# EAGLE design 4ch_v3 (EAGLE 5.11)
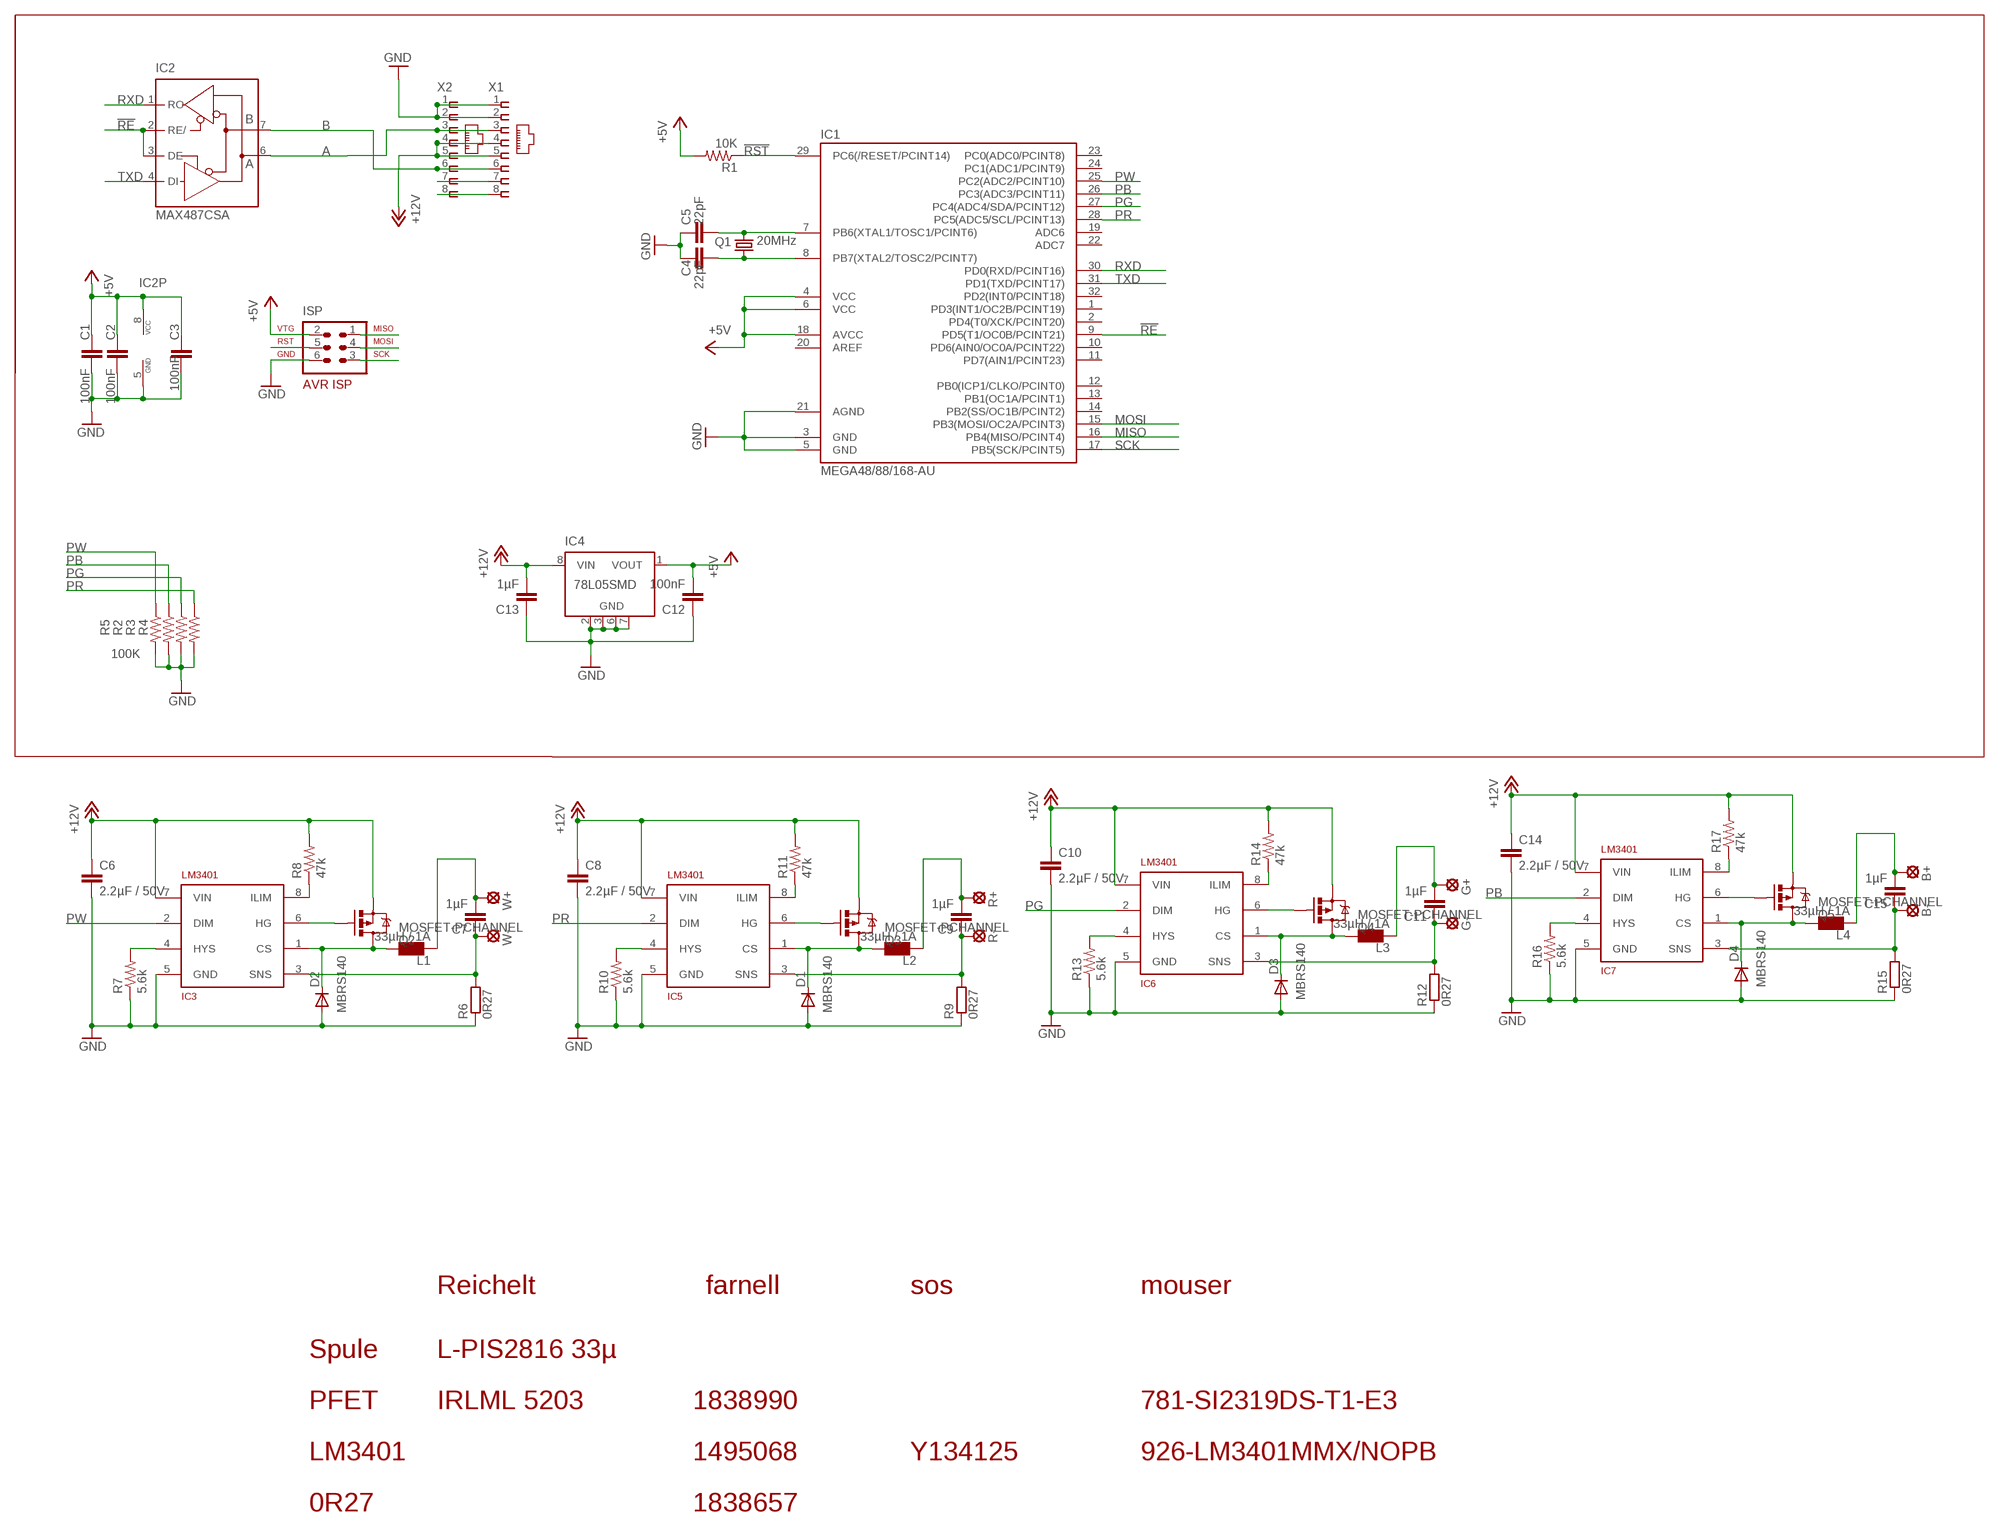
[diagram p0: schematic, sheet 1]

## Parts
B+  SE14  [SE14]
B-  SE14  [SE14]
C1  100nF  CAP0402-CAP  [0402-CAP]
C2  100nF  CAP0402-CAP  [0402-CAP]
C3  100nF  CAP0402-CAP  [0402-CAP]
C4  22pF  CAP0402-CAP  [0402-CAP]
C5  22pF  CAP0402-CAP  [0402-CAP]
C6  2.2µF / 50V  C-EUC1210  [C1210]
C7  1µF  CAP0805  [0805]
C8  2.2µF / 50V  C-EUC1210  [C1210]
C9  1µF  CAP0805  [0805]
C10  2.2µF / 50V  C-EUC1210  [C1210]
C11  1µF  CAP0805  [0805]
C12  100nF  CAP0402-CAP  [0402-CAP]
C13  1µF  CAP0805  [0805]
C14  2.2µF / 50V  C-EUC1210  [C1210]
C15  1µF  CAP0805  [0805]
D1  MBRS140  DIODE-SMB  [SMB]
D2  MBRS140  DIODE-SMB  [SMB]
D3  MBRS140  DIODE-SMB  [SMB]
D4  MBRS140  DIODE-SMB  [SMB]
G+  SE14  [SE14]
G-  SE14  [SE14]
IC1  MEGA48/88/168-AU  [TQFP32-08]
IC2  MAX487CSA  MAX481CSA  [SO08]
IC3  LM3401  [MSOP8]
IC4  78L05SMD  [SO08]
IC5  LM3401  [MSOP8]
IC6  LM3401  [MSOP8]
IC7  LM3401  [MSOP8]
ISP  AVR-ISP-6  [AVR-ISP-6]
L1  33µH / 1A  L_PIS2816  [PIS2816]
L2  33µH / 1A  L_PIS2816  [PIS2816]
L3  33µH / 1A  L_PIS2816  [PIS2816]
L4  33µH / 1A  L_PIS2816  [PIS2816]
Q1  20MHz  X22-OSCILLATOR  [X22]
Q2  MOSFET-PCHANNEL  [SOT23]
Q3  MOSFET-PCHANNEL  [SOT23]
Q4  MOSFET-PCHANNEL  [SOT23]
Q5  MOSFET-PCHANNEL  [SOT23]
R1  10K  RESISTOR0402-RES  [0402-RES]
R2  100K  RESISTOR0402-RES  [0402-RES]
R3  100K  RESISTOR0402-RES  [0402-RES]
R4  100K  RESISTOR0402-RES  [0402-RES]
R5  100K  RESISTOR0402-RES  [0402-RES]
R6  0R27  R-EU_R1206  [R1206]
R7  5.6k  RESISTOR0805-RES  [0805]
R8  47k  RESISTOR0805-RES  [0805]
R9  0R27  R-EU_R1206  [R1206]
R10  5.6k  RESISTOR0805-RES  [0805]
R11  47k  RESISTOR0805-RES  [0805]
R12  0R27  R-EU_R1206  [R1206]
R13  5.6k  RESISTOR0805-RES  [0805]
R14  47k  RESISTOR0805-RES  [0805]
R15  0R27  R-EU_R1206  [R1206]
R16  5.6k  RESISTOR0805-RES  [0805]
R17  47k  RESISTOR0805-RES  [0805]
R+  SE14  [SE14]
R-  SE14  [SE14]
W+  SE14  [SE14]
W-  SE14  [SE14]
X1  RJ45-8L-B  [RJ45-NO-SHIELD]
X2  RJ45-8L-B  [RJ45-NO-SHIELD]

## Nets
!RE: IC1.9(PD5(T1/OC0B/PCINT21)) IC2.2(RE/) IC2.3(DE)
!RST: IC1.29(PC6(/RESET/PCINT14)) ISP.5 R1.1
+5V: C1.1 C2.1 C3.1 C12.2 IC1.4(VCC) IC1.6(VCC) IC1.18(AVCC) IC2.8(VCC) IC4.1(VOUT) ISP.2 R1.2
+12V: C6.1 C8.1 C10.1 C13.2 C14.1 IC3.7(VIN) IC4.8(VIN) IC5.7(VIN) IC6.7(VIN) IC7.7(VIN) Q2.2(S) Q3.2(S) Q4.2(S) Q5.2(S) R8.2 R11.2 R14.2 R17.2 X1.4 X1.5 X2.4 X2.5
A: IC2.6(A) X1.3 X2.3
B: IC2.7(B) X1.6 X2.6
GND: C1.2 C2.2 C3.2 C4.1 C5.1 C6.2 C8.2 C10.2 C12.1 C13.1 C14.2 D1.A D2.A D3.A D4.A IC1.3(GND) IC1.5(GND) IC1.21(AGND) IC2.5(GND) IC3.5(GND) IC4.2(GND) IC4.3(GND) IC4.6(GND) IC4.7(GND) IC5.5(GND) IC6.5(GND) IC7.5(GND) ISP.6 R2.2 R3.2 R4.2 R5.2 R6.1 R7.1 R9.1 R10.1 R12.1 R13.1 R15.1 R16.1 X1.1 X1.2 X2.1 X2.2
MISO: IC1.16(PB4(MISO/PCINT4)) ISP.1
MOSI: IC1.15(PB3(MOSI/OC2A/PCINT3)) ISP.4
N$1: C7.1 IC3.3(SNS) R6.2 W-.MP
N$2: C7.2 L1.P$2 W+.MP
N$3: D2.C IC3.1(CS) L1.P$1 Q2.3(D)
N$4: C9.1 IC5.3(SNS) R9.2 R-.MP
N$5: IC3.4(HYS) R7.2
N$6: C9.2 L2.P$2 R+.MP
N$7: IC3.8(ILIM) R8.1
N$8: D1.C IC5.1(CS) L2.P$1 Q3.3(D)
N$9: IC5.4(HYS) R10.2
N$10: IC3.6(HG) Q2.1(G)
N$11: IC5.8(ILIM) R11.1
N$12: IC5.6(HG) Q3.1(G)
N$13: C11.1 G-.MP IC6.3(SNS) R12.2
N$14: C11.2 G+.MP L3.P$2
N$15: D3.C IC6.1(CS) L3.P$1 Q4.3(D)
N$16: IC6.4(HYS) R13.2
N$17: IC6.8(ILIM) R14.1
N$18: X1.7 X2.7
N$19: X1.8 X2.8
N$20: IC6.6(HG) Q4.1(G)
N$21: B-.MP C15.1 IC7.3(SNS) R15.2
N$22: B+.MP C15.2 L4.P$2
N$23: D4.C IC7.1(CS) L4.P$1 Q5.3(D)
N$24: IC7.4(HYS) R16.2
N$25: IC7.8(ILIM) R17.1
N$26: IC7.6(HG) Q5.1(G)
PB: IC1.26(PC3(ADC3/PCINT11)) IC7.2(DIM) R2.1
PG: IC1.27(PC4(ADC4/SDA/PCINT12)) IC6.2(DIM) R3.1
PR: IC1.28(PC5(ADC5/SCL/PCINT13)) IC5.2(DIM) R4.1
PW: IC1.25(PC2(ADC2/PCINT10)) IC3.2(DIM) R5.1
RXD: IC1.30(PD0(RXD/PCINT16)) IC2.1(RO)
SCK: IC1.17(PB5(SCK/PCINT5)) ISP.3
TXD: IC1.31(PD1(TXD/PCINT17)) IC2.4(DI)
XTAL1: C5.2 IC1.7(PB6(XTAL1/TOSC1/PCINT6)) Q1.3
XTAL2: C4.2 IC1.8(PB7(XTAL2/TOSC2/PCINT7)) Q1.1
Unconnected: IC1.1(PD3(INT1/OC2B/PCINT19)) IC1.2(PD4(T0/XCK/PCINT20)) IC1.10(PD6(AIN0/OC0A/PCINT22)) IC1.11(PD7(AIN1/PCINT23)) IC1.12(PB0(ICP1/CLKO/PCINT0)) IC1.13(PB1(OC1A/PCINT1)) IC1.14(PB2(SS/OC1B/PCINT2)) IC1.19(ADC6) IC1.20(AREF) IC1.22(ADC7) IC1.23(PC0(ADC0/PCINT8)) IC1.24(PC1(ADC1/PCINT9)) IC1.32(PD2(INT0/PCINT18)) IC4.4(NC) IC4.5(NC)

## Notes on the sheet
- Reichelt | farnell | sos | mouser
- Spule | L-PIS2816 33µ
- PFET | IRLML 5203 | 1838990 | 781-SI2319DS-T1-E3
- LM3401 | 1495068 | Y134125 | 926-LM3401MMX/NOPB
- 0R27 | 1838657

## Library data of the parts
B+ B- G+ G- R+ R- W+ W- = solpad:SE14: SOLDER PAD E1553, drill 1,4mm, distributor Buerklin, 07F820
C1-C5 C7 C9 C11-C13 C15 = SparkFun:CAP: Capacitor Standard 0603 ceramic capacitor, and 0.1" leaded capacitor.
C6 C8 C10 C14 = rcl:C-EU: CAPACITOR, European symbol
D1-D4 = diode:DIODE-: DIODE
IC1 = avr-7:MEGA48/88/168
IC2 = maxim:MAX481CSA: RS485 TRANSEIVER; MF: MAXIM; MPN: MAX481CSA; OC_FARNELL: unknown; OC_NEWARK: 90C3817
IC3 IC5-IC7 = seb:LM3401
IC4 = linear:78L*SMD: Positive VOLTAGE REGULATOR
ISP = atmel:AVR-ISP-6: AVR ISP-6 Serial Programming Header
L1-L4 = seb:L_PIS2816
Q1 = seb:X22-OSCILLATOR
Q2-Q5 = SparkFun:MOSFET-PCHANNEL
R1-R5 R7 R8 R10 R11 R13 R14 R16 R17 = SparkFun:RESISTOR: Resistor Basic schematic elements and footprints for 0603, 1206, and PTH resistors.
R6 R9 R12 R15 = rcl:R-EU_: RESISTOR, European symbol
X1 X2 = con-tycoelectronics:RJ45: CORCOM Modular RJ Jacks No Shield Source: www.tycoelectronics.com .. ENG_DS_1654001_1099_RJ_L_0507.pdf; MF: TYCO ELECTRONICS; MPN: RJ45-8L-B; OC_FARNELL: 1279843; OC_NEWARK: 52K4445

## Board
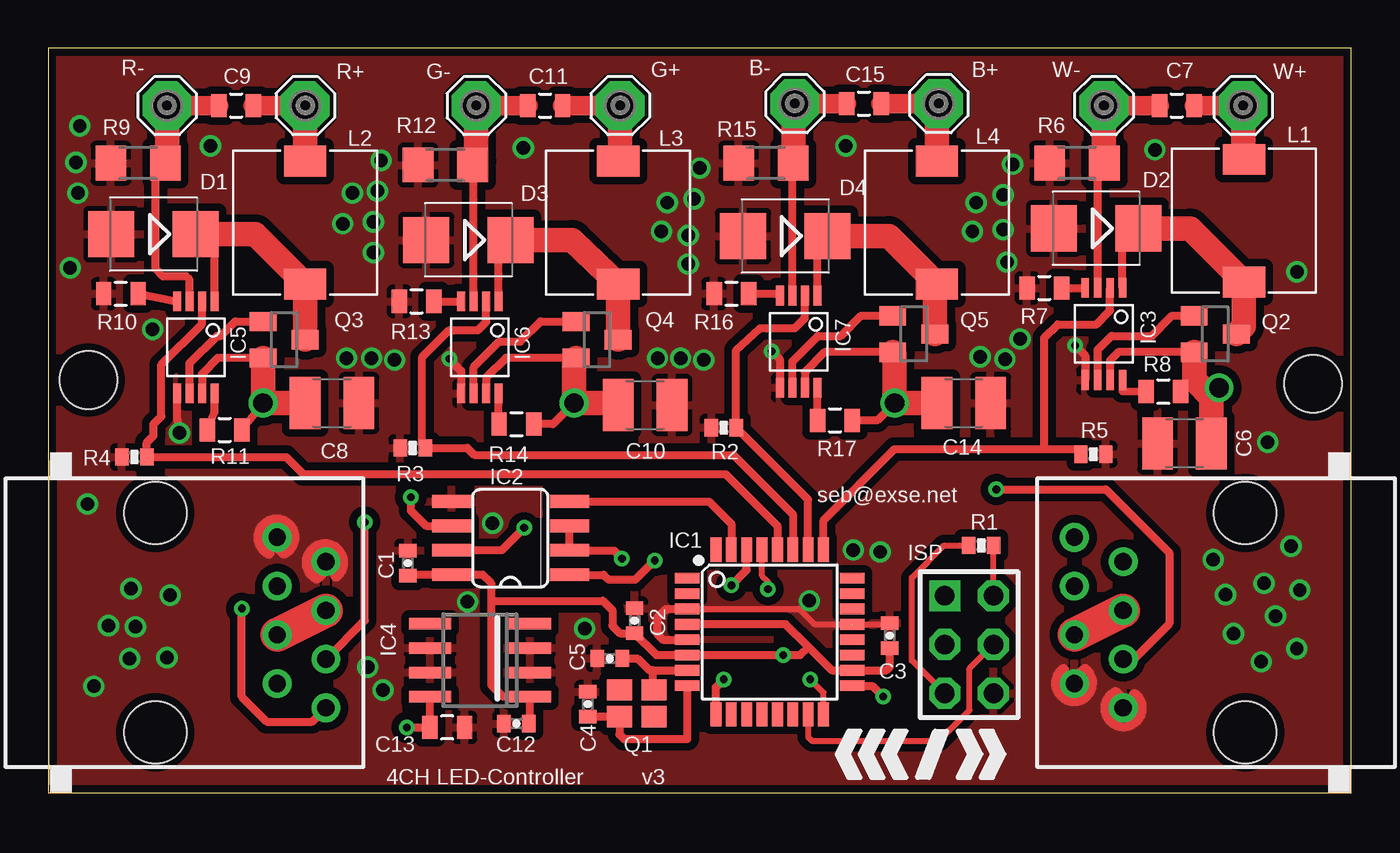
[diagram p1: board, top side]
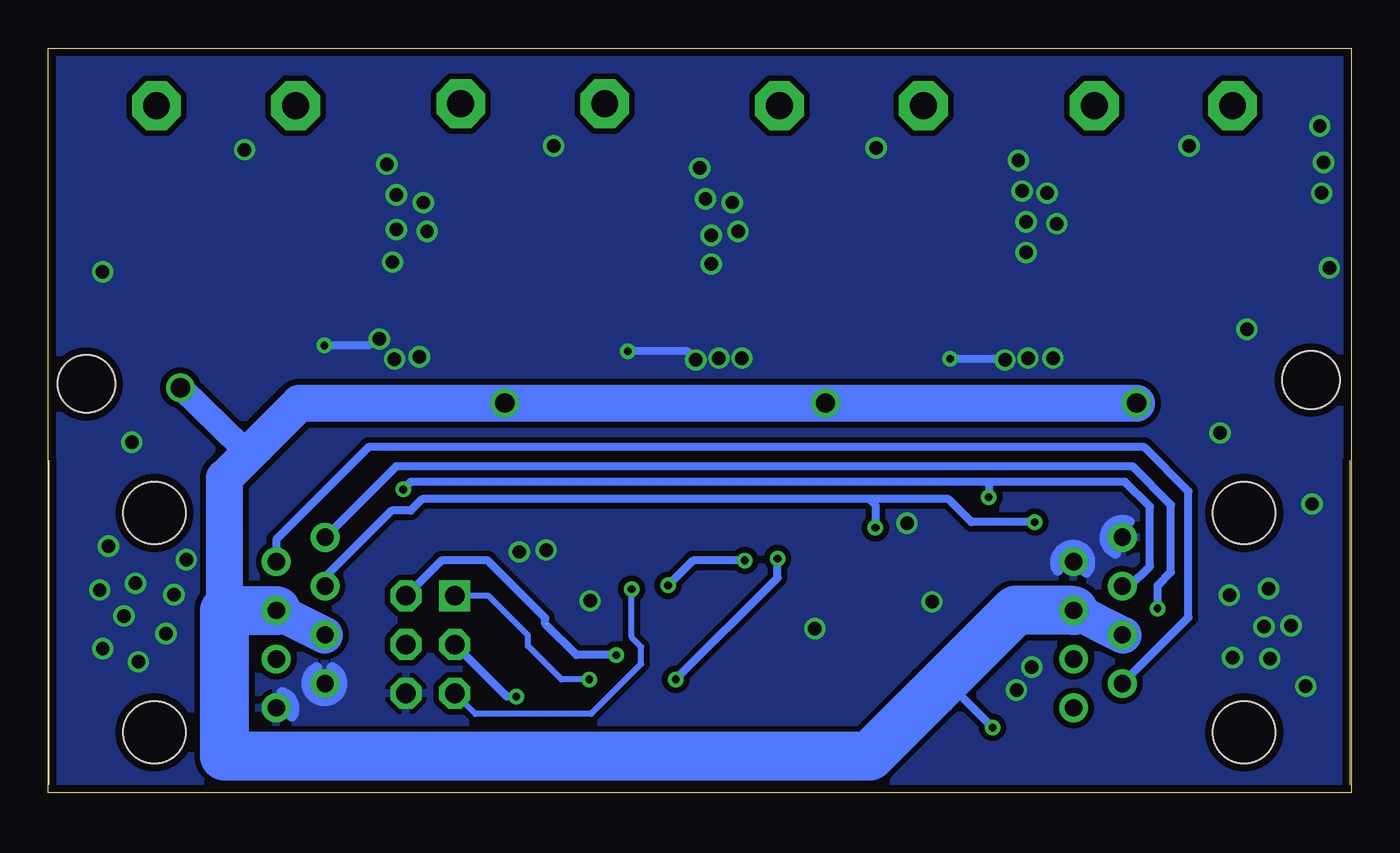
[diagram p2: board, bottom side, seen from below]

Size 67.9 x 38.8 mm. Coordinates in mm from the lower left corner, seen from the top.
Outline: 0,0 67.9,0 67.9,38.8 0,38.8 0,0
Copper layers (1*16): Top 0.035mm / dielectric 1.5mm / Bottom 0.035mm
Design rules "default *": minimum track width 0.2mm, minimum drill 0.5mm, track to track 0.2mm, track to pad 0.2mm, pad to pad 0.2mm, via to via 0.2mm, smd to smd 0mil, copper to edge 0.4mm, drill to drill 8mil, minimum pad ring 0.3mm, minimum via ring 8mil, stop-mask expansion 4mil, vias tented up to drill 40mil, thermal gap 10mil
Holes 3 mm at 2.1,21.5 65.9,21.3

### Footprints (pad centres in the part's own frame; a part is rotated, then mirrored left to right if it is on the bottom)
SE14 = drill 1.397 pad 2.54 octagon: MP 0,0
0402-CAP = smd 0.7 x 0.9: 1 -0.65,0; 2 0.65,0
C1210 = smd 1.6 x 2.7: 1 -1.4,0; 2 1.4,0
0805 = smd 0.8 x 1.2: 1 -0.9,0; 2 0.9,0
SMB = smd 2.4 x 2.4: A 2.2,0; C -2.2,0
TQFP32-08 = smd 1.27 x 0.559: 1 -4.293,2.8; 2 -4.293,2; 3 -4.293,1.2; 4 -4.293,0.4; 5 -4.293,-0.4; 6 -4.293,-1.2; 7 -4.293,-2; 8 -4.293,-2.8; 17 4.293,-2.8; 18 4.293,-2; 19 4.293,-1.2; 20 4.293,-0.4; 21 4.293,0.4; 22 4.293,1.2; 23 4.293,2; 24 4.293,2.8 | smd 0.559 x 1.27: 9 -2.8,-4.293; 10 -2,-4.293; 11 -1.2,-4.293; 12 -0.4,-4.293; 13 0.4,-4.293; 14 1.2,-4.293; 15 2,-4.293; 16 2.8,-4.293; 25 2.8,4.293; 26 2,4.293; 27 1.2,4.293; 28 0.4,4.293; 29 -0.4,4.293; 30 -1.2,4.293; 31 -2,4.293; 32 -2.8,4.293
SO08 = smd 0.66 x 2.032: 1 -1.905,-3.073; 2 -0.635,-3.073; 3 0.635,-3.073; 4 1.905,-3.073; 5 1.905,3.073; 6 0.635,3.073; 7 -0.635,3.073; 8 -1.905,3.073
MSOP8 = smd 0.41 x 1.02: 1 -0.975,-2.4; 2 -0.325,-2.4; 3 0.325,-2.4; 4 0.975,-2.4; 5 0.975,2.4; 6 0.325,2.4; 7 -0.325,2.4; 8 -0.975,2.4
SO08' = smd 0.6 x 2.2: 1 -1.905,-2.6; 2 -0.635,-2.6; 3 0.635,-2.6; 4 1.905,-2.6; 5 1.905,2.6; 6 0.635,2.6; 7 -0.635,2.6; 8 -1.905,2.6
AVR-ISP-6 = drill 1.016 square: 1 -2.54,-1.27 | drill 1.016 octagon: 2 -2.54,1.27; 3 0,-1.27; 4 0,1.27; 5 2.54,-1.27; 6 2.54,1.27
PIS2816 = smd 2.2 x 1.6: P$1 0,3.2; P$2 0,-3.2
X22 = smd 1.3 x 1.1: 1 0.9,0.7; 2 -0.9,0.7; 3 -0.9,-0.7; 4 0.9,-0.7
SOT23 = smd 1 x 1.4: 1 -0.95,-1.1; 2 0.95,-1.1; 3 0,1.1
0402-RES = smd 0.7 x 0.9: 1 -0.65,0; 2 0.65,0
R1206 = smd 1.6 x 1.803: 1 -1.422,0; 2 1.422,0
RJ45-NO-SHIELD = drill 0.9 pad 1.4 round: 1 -4.445,6.35; 2 -3.175,8.89; 3 -1.905,6.35; 4 -0.635,8.89; 5 0.635,6.35; 6 1.905,8.89; 7 3.175,6.35; 8 4.445,8.89 | hole 3.251: -5.715,0; 5.715,0

### Placement (x,y rotation side)
B+  46.4,35.9 0 top
B-  38.9,35.9 0 top
C1  18.75,11.97 90 top
C2  30.56,8.96 90 top
C3  43.85,8.19 90 top
C4  28.12,4.61 270 top
C5  29.26,6.99 0 top
C6  59.2,18.2 180 top
C7  58.8,35.8 0 top
C8  14.8,20.3 0 top
C9  9.8,35.8 0 top
C10  31.1,20.2 0 top
C11  25.9,35.8 0 top
C12  24.4,3.6 0 top
C13  20.8,3.4 180 top
C14  47.7,20.3 0 top
C15  42.5,35.9 0 top
D1  5.5,29.1 180 top
D2  54.6,29.4 180 top
D3  21.9,28.8 180 top
D4  38.4,29 180 top
G+  29.8,35.8 0 top
G-  22.3,35.8 0 top
IC1  37.59,8.37 0 top
IC2  24.08,13.26 90 top
IC3  55,23.9 180 top
IC4  78L05SMD  [SO08']  22.5,6.9 90 top
IC5  7.7,23.2 180 top
IC6  22.5,23.2 180 top
IC7  39.1,23.5 180 top
ISP  47.98,7.72 270 top
L1  62.3,29.8 180 top
L2  13.4,29.7 180 top
L3  29.7,29.7 180 top
L4  46.3,29.7 180 top
Q1  30.67,4.66 180 top
Q2  60.8,23.9 270 top
Q3  12.3,23.6 270 top
Q4  28.6,23.6 270 top
Q5  45.1,23.9 270 top
R1  48.61,12.88 0 top
R2  35.2,19.02 180 top
R3  19,17.96 180 top
R4  4.5,17.49 180 top
R5  54.45,17.63 0 top
R6  53.6,32.8 0 top
R7  51.9,26.3 0 top
R8  58.1,20.9 0 top
R9  4.7,32.8 0 top
R10  3.8,26 0 top
R11  9.2,18.9 0 top
R12  20.7,32.7 0 top
R13  19.2,25.6 0 top
R14  24.4,19.2 0 top
R15  37.4,32.8 0 top
R16  35.6,26 0 top
R17  41,19.4 0 top
R+  13.4,35.8 0 top
R-  6.2,35.8 0 top
W+  62.25,35.8 0 top
W-  55,35.8 0 top
X1  62.36,8.86 90 top
X2  5.59,8.86 270 top

### Tracks (layer width: path | path; a pad name or v marks a point on that pad's centre or on a via)
!RE  (via drill 0.4)
  Top 0.406: 34.8,4 IC1.9 34.8,5.5 v35.2,5.9 | IC2.3 IC2.2 27.19,12.6 29.5,12.6 v29.9,12.2
  Bottom 0.406: v29.9,12.2 29.9,11.2 v35.2,5.9
!RST  (via drill 0.4)
  Top 0.305: IC1.29 37.2,11.3 37.5,11 v37.5,10.6 | ISP.5 45,6.88 45,11.2 46.68,12.88 R1.1
  Bottom 0.305: v37.5,10.6 37.5,8.1 37,7.6 37,6.7 39.6,4.1 45.63,4.1 ISP.5
+5V  (via drill 0.4)
  Top 0.305: R1.2 49.25,12.87 ISP.2
  Top 0.406: 39.6,7.6 38.43,8.77 IC1.4 | 39.6,7.6 40.83,6.37 IC1.18 43.67,6.37 43.85,6.55 C3.1 | 39.6,7.6 39.17,7.17 v38.3,7.17 IC1.6 31.69,7.17 C2.1 29.79,8.31 29.4,8.7 29.4,9.5 28.9,10 23.1,10 | C12.2 25.1,3.55 IC4.1 23.7,5 23.1,5.6 23.1,10 | C1.1 18.79,11.36 IC2.8 22.64,11.36 23.1,10.9 23.1,10
  Bottom 0.406: v38.3,7.17 40.37,7.17 42,8.8 42,9.1 45,12.1 47.4,12.1 ISP.2
+12V  (via drill 0.4, 1)
  Top 0.406: IC5.7 8.03,21.82 8.85,22.65 Q3.2 | IC6.7 22.82,21.62 23.85,22.65 Q4.2 | IC7.7 39.42,21.93 40.45,22.95 Q5.2 | IC3.7 55.33,22.52 55.75,22.95 Q2.2 | R17.2 43.2,19.4 v44.1,20.3 | R14.2 26.3,19.2 v27.4,20.3 | v11.2,20.3 R11.2 | IC4.8 C13.2 v18.7,3.4
  Top 0.61: R8.2 59.7,21.6 59.7,21.8
  Top 1.27: C8.1 v11.2,20.3 Q3.2 | C10.1 29.6,20.3 v27.4,20.3 27.4,22.55 Q4.2 | C14.1 v44.1,20.3 44.1,22.85 Q5.2 | 60.6,20.6 C6.1 | 60.6,20.6 59.7,21.5 59.7,21.8 Q2.2 | 60.6,20.6 61,21 v61,21.1
  Top 1.778: X2.5 X2.4 | X1.5 X1.4
  Bottom 0.406: v18.7,3.4 20.55,5.25 21.75,5.25
  Bottom 1.27: v61,21.1 57.85,18.05 57.05,18.05
  Bottom 1.93: v11.2,20.3 v27.4,20.3 v44.1,20.3 54.8,20.3 57.05,18.05 58.7,16.4 58.7,9.49
  Bottom 2.54: X2.4 17.5,9.5 21.75,5.25 25.1,1.9 58.7,1.9 58.7,9.49 X1.5
A  (via drill 0.4)
  Top 0.406: X1.3 56.55,6.96 58.4,8.8 58.4,12.5 55.1,15.8 v49.4,15.8 | IC2.6 19.7,13.9 18.9,14.7 v18.9,15.4
  Bottom 0.406: v49.4,15.8 49,16.2 18.9,16.2 | X2.3 11.54,10.77 10.5,11.8 10.5,14.9 11.8,16.2 18.9,16.2 | 18.9,16.2 v18.9,15.4
B  (via drill 0.4)
  Top 0.406: v16.5,14.1 16.5,8.98 X2.6 | IC2.7 23.63,12.63 v24.8,13.8
  Bottom 0.406: 25.1,15.3 48.4,15.3 49,14.7 50,14.7 53.44,11.27 X1.6 | v24.8,13.8 24.8,15 25.1,15.3 | v16.5,14.1 19.8,14.1 21,15.3 25.1,15.3
GND  (via drill 0.4, 0.7)  (1 unrouted)
  Top 0.305: 41.93,8.77 43.89,8.77 | IC1.21 39.93,8.77 39.1,9.6 39.07,9.57 IC1.3
  Top 0.406: IC1.5 32.03,7.97 31.75,8.25 31.75,9.14 32.19,9.57 IC1.3 | IC5.5 6.72,19.57 v6.85,18.74 | IC3.5 54.02,22.77 v53.5,23.3 | IC7.5 38.12,22.57 v37.7,23 | IC6.5 21.52,21.98 v20.9,22.6
  Top 0.61: 52.9,6.4 arc284 54,6.4 53.47,5.87 X1.2 | 56.6,5.1 arc-293 55.6,5.2 56.01,4.79 X1.1 | 11.5,12.5 arc-307 12.3,12.5 11.94,12.86 X2.1 | 15,11.3 arc293 14,11.2 14.48,11.68 X2.2
  Bottom 0.406: v53.5,23.3 51.2,23.3 v50.64,23.64 | v37.7,23 34.61,23 v34.15,22.54 | v20.9,22.6 18.11,22.6 v18.05,22.54
  Bottom 0.61: 12.3,12.5 arc180 11.6,14.1 11.94,13.76 X2.1 | 15.3,11.6 arc242 13.8,11.5 14.34,12.04 X2.2 | 53.9,6.5 arc-307 53.1,6.5 53.1,6.05 X1.2 | 55.2,4 arc-100 55.7,5.2 55.7,4.72 X1.1
  other vias: 57.66,33.5 4.55,8.64 39.66,10 65.2,10.56 63.2,6.82 63.54,18.26 49.85,22.59 48.56,22.71 3.15,8.7 2.38,5.54 60.7,12.14 6.36,10.3 65.05,7.51 4.25,6.99 4.32,10.63 63.95,9.21 6.19,7.03 61.75,8.29 63.35,10.91 61.34,10.32 32.95,22.64 31.75,22.64 15.55,22.64 16.85,22.64 16.95,28.14 16.95,29.74 17.15,31.34 17.35,32.94 1.15,27.34 1.55,31.24 1.45,32.84 1.65,34.74 49.95,27.64 49.75,29.34 49.75,31.14 50.25,32.74 33.35,27.54 33.35,29.04 33.65,30.94 33.95,32.54 15.35,29.64 15.85,31.24 31.95,29.24 32.25,30.74 48.15,29.24 48.35,30.74 64.75,12.84 65.05,27.14 16.65,6.54 17.45,5.34 23.15,14.04 43.35,12.54 21.85,9.94 41.95,12.64 27.95,8.54 41.56,33.7 24.76,33.6 8.46,33.7 5.45,24.14 2.05,15.04
  pour Bottom (isolate 0.305, rank 2): 0.04,38.78 0.1,0 67.89,0 67.88,38.78
  pour Top (isolate 0.406, rank 2): 0.01,38.75 0,0 67.82,0 67.88,38.78
MISO  (via drill 0.4)
  Top 0.305: v39.7,5.9 40.4,5.21 IC1.16
  Bottom 0.305: v39.7,5.9 41.15,5.9 42.9,7.65 42.9,8.2 44.96,10.26 ISP.1
MOSI
  Top 0.305: IC1.15 39.59,2.9 39.8,2.7 46.4,2.7 48,4.3 48,6.47 ISP.4
N$1
  Top 0.406: IC3.3 54.67,32.35 R6.2
  Top 1.016: W-.MP C7.1
  Top 1.27: W-.MP 55,32.82 R6.2
N$2
  Top 1.016: W+.MP C7.2
  Top 1.27: W+.MP 62.25,33.05 L1.P$2
N$3
  Top 0.406: IC3.1 55.98,28.68 D2.C
  Top 1.27: D2.C 59.5,29.4 L1.P$1 62.3,24.3 Q2.3
N$4
  Top 0.406: 5.88,32.55 R9.2 5.6,32.28 5.6,27.3 6,26.9 7.2,26.9 7.38,26.73 IC5.3
  Top 1.016: R-.MP C9.1
  Top 1.27: R9.2 6.2,32.88 R-.MP
N$5
  Top 0.406: R7.2 IC3.4
N$6
  Top 1.016: R+.MP C9.2
  Top 1.27: L2.P$2 R+.MP
N$7
  Top 0.406: IC3.8 55.98,20.93 R8.1
N$8
  Top 0.406: IC5.1 8.68,28.68 D1.C
  Top 1.27: D1.C 10.8,29.1 L2.P$1 Q3.3
N$9
  Top 0.406: R10.2 IC5.4
N$10
  Top 0.406: IC3.6 54.67,23.07 55.4,23.8 57.5,23.8 58.55,24.85 Q2.1
N$11
  Top 0.406: IC5.8 8.68,19.82 R11.1
N$12
  Top 0.406: IC5.6 7.38,22.38 8.8,23.8 9,23.8 9.75,24.55 Q3.1
N$13
  Top 0.406: IC6.3 22.18,32.25 R12.2
  Top 1.016: G-.MP C11.1
  Top 1.27: R12.2 22.3,32.88 G-.MP
N$14
  Top 1.016: G+.MP C11.2
  Top 1.27: L3.P$2 29.8,32.9 G+.MP
N$15
  Top 0.406: IC6.1 23.48,28.27 D3.C
  Top 1.27: D3.C 27.3,28.8 L3.P$1 Q4.3
N$16
  Top 0.406: R13.2 IC6.4
N$17
  Top 0.406: IC6.8 23.48,19.23 R14.1
N$18
  Bottom 0.406: X1.7 56.01,13.19 51.2,18 10.8,18 8.5,15.7 8.5,9.12 X2.7
N$19  (via drill 0.4)
  Top 0.406: v10.1,9.6 10.1,5 11.4,3.7 13.76,3.7 X2.8
  Bottom 0.406: X1.8 49.77,17 11.4,17 9.4,15 9.4,11.5 10.1,10.8 v10.1,9.6
N$20
  Top 0.406: IC6.6 22.18,22.18 23.5,23.5 24.6,23.5 25.65,24.55 Q4.1
N$21
  Top 0.406: IC7.3 38.77,32.05 R15.2
  Top 1.016: B-.MP C15.1
  Top 1.27: B-.MP 38.82,35.82 R15.2
N$22
  Top 1.016: B+.MP C15.2
  Top 1.27: B+.MP 46.3,35.8 L4.P$2
N$23
  Top 0.406: IC7.1 40.08,28.38 D4.C
  Top 1.27: D4.C 43.8,29 L4.P$1 46.2,26.4 Q5.3
N$24
  Top 0.406: R16.2 37.92,26 IC7.4
N$25
  Top 0.406: IC7.8 40.08,19.43 R17.1
N$26
  Top 0.406: IC7.6 38.77,22.48 40.1,23.8 41.3,23.8 42.35,24.85 Q5.1
N$27
  Bottom 1.93: 11.9,8.2 14.5,9.5
N$28
  Bottom 1.93: 53.5,8.2 56.1,9.5
PB
  Top 0.406: IC1.26 39.59,15.27 R2.1 35.85,23.05 37.1,24.2 38.9,24.2 39.42,24.73 IC7.2
PG
  Top 0.406: IC1.27 38.8,14.51 35.7,17.6 22.2,17.6 21.84,17.96 R3.1 19.5,18.11 19.5,22.7 20.9,24.1 22.4,24.1 22.82,24.52 IC6.2
PR
  Top 0.406: IC5.2 8.03,24.43 5.9,22.3 5.9,19.6 5.5,19.2 5.5,18.6 5.15,18.25 R4.1 12.41,17.49 13.3,16.6 35.3,16.6 37.99,13.9 IC1.28
PW
  Top 0.406: IC3.2 55.33,25.12 54.6,24.4 52.6,24.4 51.9,23.7 51.9,17.9 | 51.9,17.9 44.1,17.9 40.4,14.2 IC1.25 | R5.1 53.54,17.9 51.9,17.9
RXD  (via drill 0.4)
  Top 0.406: v35.6,10.8 36.4,11.6 IC1.30 | IC2.1 28.94,11.36 29.2,11.1 30.6,11.1 v31.6,12.1
  Bottom 0.406: v31.6,12.1 34.3,12.1 v35.6,10.8
SCK  (via drill 0.4)
  Top 0.305: IC1.17
  Top 0.406: IC1.17 42.94,5.56 v43.5,5
  Bottom 0.406: v43.5,5 43.99,5 ISP.3
TXD
  Top 0.406: IC1.31 35.59,14.01 34.43,15.17 IC2.4
XTAL1
  Top 0.406: 31.5,6.37 31.33,6.37 30.71,6.99 C5.2 | 31.5,6.37 IC1.7 | Q1.3 31.5,5.23 31.5,6.37
XTAL2
  Top 0.406: Q1.1 29.84,3.69 | IC1.8 33.3,2.8 30,2.8 29.77,3.03 Q1.1 | Q1.1 C4.2

### Text on the board
tNames: seb@exse.net | 4CH LED-Controller | v3